# Altium schematic sheet 1.27to2.54.SchDoc
size A4; SheetNumber: 5; SheetTotal: 5
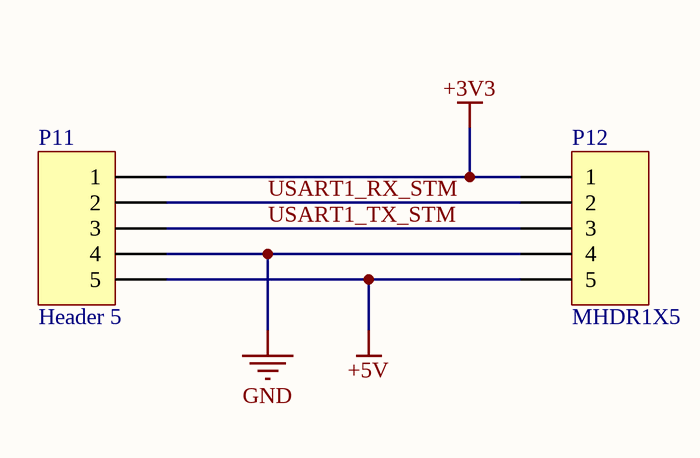
[diagram p0: 1.27to2.54.SchDoc]

## Parts
P11  Header 5  [HDR1X5]
P12  MHDR1X5  [MHDR1X5]

## Nets
+3V3: P11.1 P12.1
+5V: P11.5 P12.5
GND: P11.4 P12.4
USART1_RX_STM: P11.2 P12.2
USART1_TX_STM: P11.3 P12.3

## Notes on the sheet
- Title
- Size:
- Date:
- A4
- Number:
- Time:
- Revision:
- Sheet
- of
- ShareFox
- File:

## Library data of the parts
P11 = Header 5: Header, 5-Pin; LatestRevisionDate: 17-Jul-2002; LatestRevisionNote: Re-released for DXP Platform.; Publisher: Altium Limited
P12 = MHDR1X5: Header, 5-Pin; LatestRevisionDate: 17-Jul-2002; LatestRevisionNote: Re-released for DXP Platform.; Publisher: Altium Limited